# Altium project PCB_Project.PrjPcb
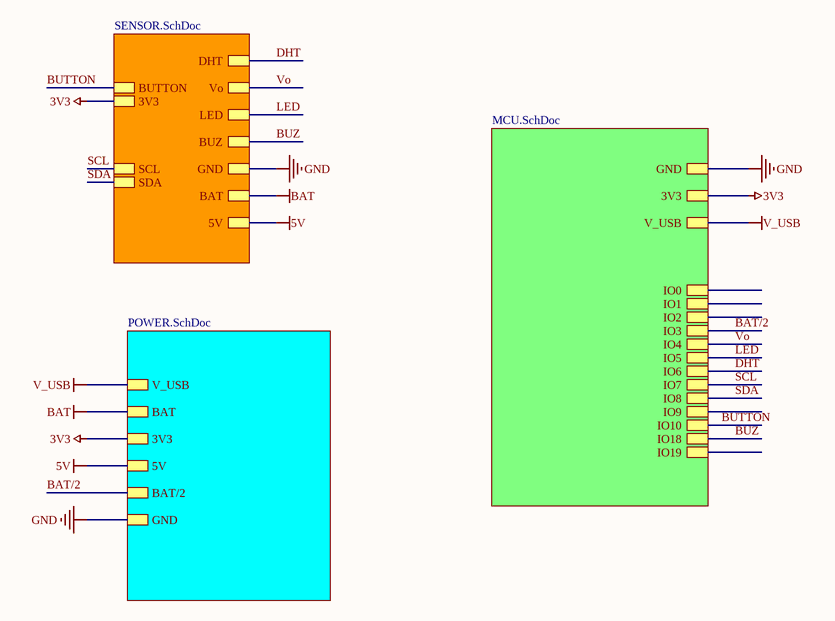
[diagram p0: AIR_QUALITY.SchDoc]
4 sheets, 62 parts. Net scope: hierarchical (ports join the sheet entries above them; power ports are global).
Board file: AIR_QUALITY.PcbDoc
Sheets:
  AIR_QUALITY.SchDoc
    Designator = SENSOR.SchDoc
    Designator = POWER.SchDoc
    MCU.SchDoc = MCU.SchDoc

## Sheet AIR_QUALITY.SchDoc
size A4; SheetNumber: 1; SheetTotal: 4

### Sub-sheets
Designator = SENSOR.SchDoc: DHT, Vo, LED, BUZ, GND, BAT, 5V, SCL, SDA, BUTTON, 3V3
Designator = POWER.SchDoc: 5V, BAT/2, BAT, 3V3, GND, V_USB
MCU.SchDoc = MCU.SchDoc: GND, 3V3, V_USB, IO0, IO1, IO2, IO3, IO4, IO5, IO6, IO7, IO8, IO9, IO10, IO18, IO19

### Nets
3V3: sheet Designator/3V3, sheet Designator/3V3, sheet MCU.SchDoc/3V3
5V: sheet Designator/5V, sheet Designator/5V
BAT: sheet Designator/BAT, sheet Designator/BAT
BUTTON: sheet Designator/GND, sheet Designator/BUTTON, sheet Designator/GND, sheet MCU.SchDoc/GND, sheet MCU.SchDoc/IO10  [also labelled GND]
V_USB: sheet Designator/V_USB, sheet MCU.SchDoc/V_USB
BAT/2: sheet Designator/BAT/2, sheet MCU.SchDoc/IO3
BUZ: sheet Designator/BUZ, sheet MCU.SchDoc/IO18
DHT: sheet Designator/DHT, sheet MCU.SchDoc/IO6
LED: sheet Designator/LED, sheet MCU.SchDoc/IO5  [project net IO5]
SCL: sheet Designator/SCL, sheet MCU.SchDoc/IO7  [project net IO7]
SDA: sheet Designator/SDA, sheet MCU.SchDoc/IO8  [project net IO8]
Vo: sheet Designator/Vo, sheet MCU.SchDoc/IO4  [project net IO4]

## Sheet SENSOR.SchDoc
size A4; SheetNumber: 4; SheetTotal: 4
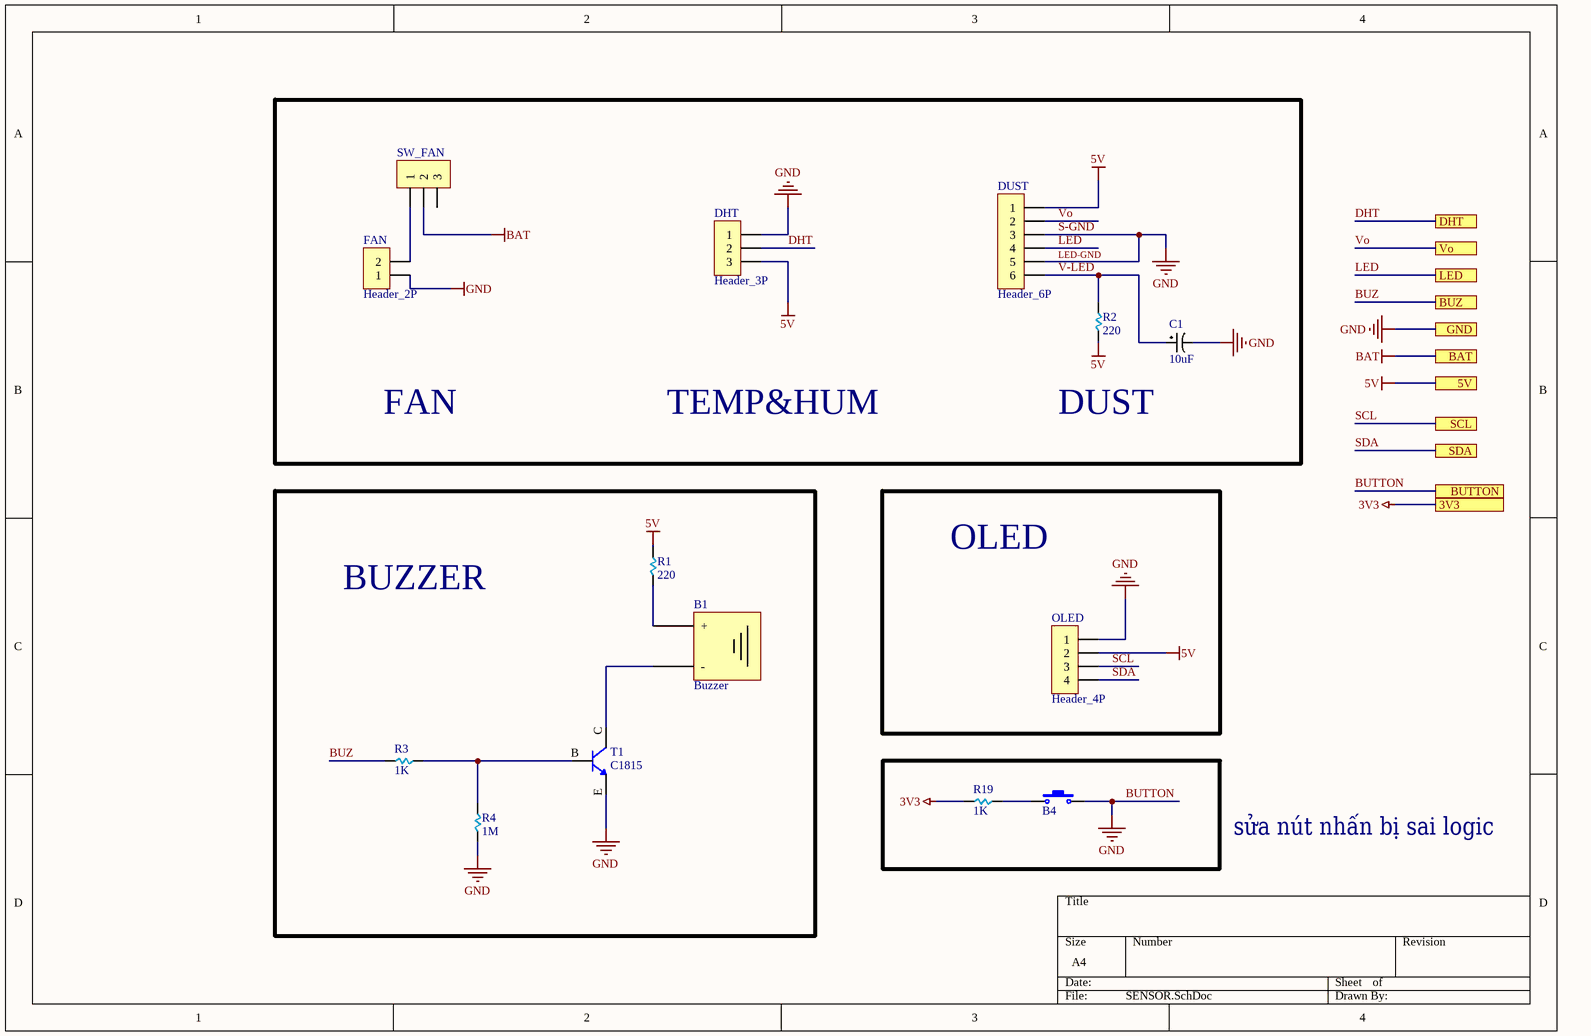
[diagram p1: SENSOR.SchDoc]

### Parts
B1  Buzzer  [Buzzer]
B4  BUTTON  [BUTTON 3x4x2]  (value not drawn)
C1  10uF  [CAP 5x11]
DHT  Header_3P  [3P_1.5_V]
DUST  Header_6P  [6P_1.5_V]
FAN  Header_2P  [2P_1.5_V]
OLED  Header_4P  [4P_1.5_V]
R1  220  [RES 0603]
R2  220  [RES 0603]
R3  1K  [RES 0603]
R4  1M  [RES 0603]
R19  1K  [RES 0603]
SW_FAN  SWITCH  [Switch SK12D07]  (value not drawn)
T1  C1815  [C1815]

### Blocks framed on the sheet
BUZZER: B1 R1 R3 R4 T1
OLED: OLED

### Ports
3V3, 5V, BAT, BUTTON, BUZ, DHT, GND, LED, SCL, SDA, Vo

### Nets
3V3: R19.2 ; port 3V3
5V: DHT.3 DUST.1 OLED.2 R1.1 R2.2 ; port 5V
BAT: SW_FAN.2 ; port BAT
BUTTON: B4.2 C1.2 DHT.1 DUST.3 DUST.5 FAN.1 OLED.1 R4.2 T1.E ; port GND, port BUTTON  [also labelled GND, LED-GND, S-GND]
BUZ: R3.1 ; port BUZ
DHT: DHT.2 ; port DHT
LED: DUST.4 ; port LED  [project net IO5]
SCL: OLED.3 ; port SCL  [project net IO7]
SDA: OLED.4 ; port SDA  [project net IO8]
V-LED: C1.1 DUST.6 R2.1
Vo: DUST.2 ; port Vo  [project net IO4]
NetB1_+: B1.+ R1.2
NetB1_-: B1.- T1.C
NetB4_1: B4.1 R19.1
NetFAN_2: FAN.2 SW_FAN.1
NetR3_2: R3.2 R4.1 T1.B

Not connected (* = marked no-connect by the designer): SW_FAN 3

### Notes on the sheet
- FAN
- TEMP&HUM
- DUST
- sửa nút nhấn bị sai logic

### Library data of the parts
C1 = Cap_P: Value: 100uF
R1-R4 R19 = RES
  R1 R2: Value: 220
  R3 R19: Value: 1K
  R4: Value: 1M

## Sheet POWER.SchDoc
size A4; SheetNumber: 3; SheetTotal: 4
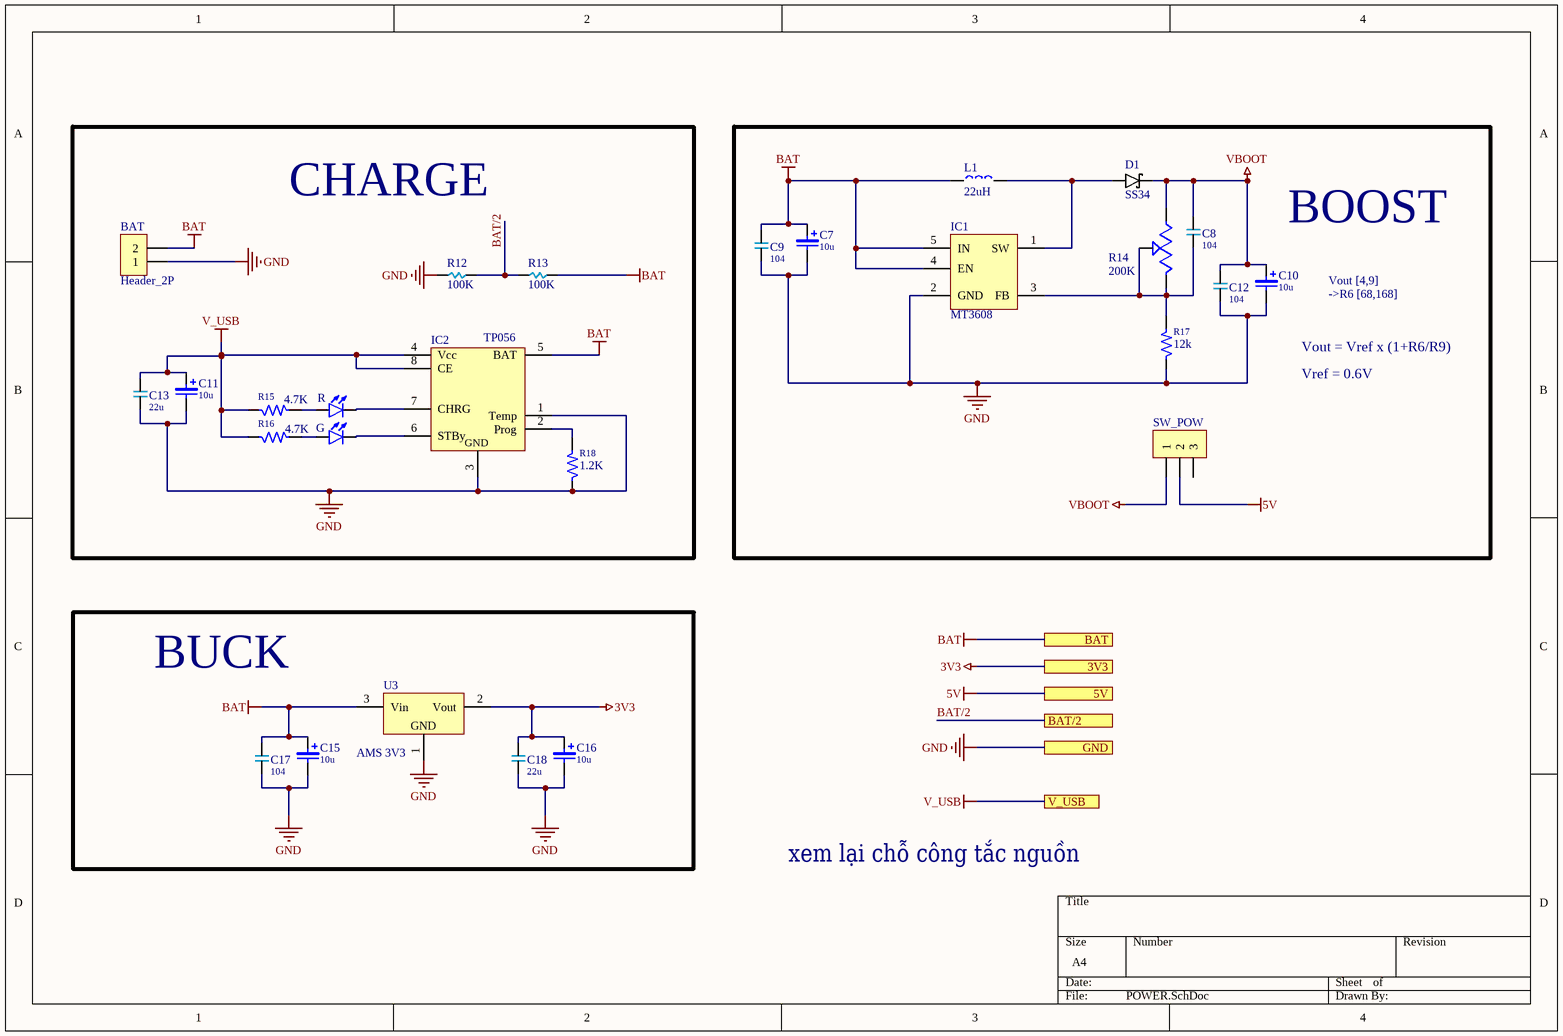
[diagram p2: POWER.SchDoc]

### Parts
BAT  Header_2P  [2P_1.5_V]
C7  10u  [CAP_T 3216 (1208)]
C8  104  [CAP 0603]
C9  104  [CAP 0603]
C10  10u  [CAP_T 3216 (1208)]
C11  10u  [CAP_T 3216 (1208)]
C12  104  [CAP 0603]
C13  22u  [CAP 0603]
C15  10u  [CAP_T 3216 (1208)]
C16  10u  [CAP_T 3216 (1208)]
C17  104  [CAP 0603]
C18  22u  [CAP 0603]
D1  SS34  [DO214AC-SMA]
G  Green  [LED 0603]  (value not drawn)
IC1  MT3608  [SOT23-6]
IC2  TP056  [SOIC 8]
L1  22uH  [INDUCTOR 0630]
R  Green  [LED 0603]  (value not drawn)
R12  100K  [RES 0603]
R13  100K  [RES 0603]
R14  200K  [RES VARIABLE]
R15  4.7K  [RES 0603]
R16  4.7K  [RES 0603]
R17  12k  [RES 0603]
R18  1.2K  [RES 0603]
SW_POW  SWITCH  [Switch SK12D07]  (value not drawn)
U3  AMS 3V3  [SOT223]

### Blocks framed on the sheet
CHARGE: BAT C11 C13 G IC2 R R12 R13 R15 R16 R18
BOOST: C7-C10 C12 D1 IC1 L1 R14 R17 SW_POW
BUCK: C15-C18 U3

### Ports
3V3, 5V, BAT, BAT/2, GND, V_USB

### Nets
3V3: C16.1 C18.2 U3.2(Vout) ; port 3V3
5V: SW_POW.2 ; port 5V
BAT: BAT.2 C7.1 C9.2 C15.1 C17.2 IC1.4(EN) IC1.5(IN) IC2.5(BAT) L1.1 R13.1 U3.3(Vin) ; port BAT
GND: BAT.1 C7.2 C9.1 C10.2 C11.2 C12.1 C13.1 C15.2 C16.2 C17.1 C18.1 IC1.2(GND) IC2.1(Temp) IC2.3(Gnd) R12.2 R17.1 R18.1 U3.1(gnd) ; port GND  [project net BUTTON]
V_USB: C11.1 C13.2 IC2.4(Vcc) IC2.8(CE) R15.1 R16.1 ; port V_USB
VBOOT: C8.2 C10.1 C12.2 D1.K R14.1 SW_POW.1
BAT/2: R12.1 R13.2 ; port BAT/2
NetC8_1: C8.1 IC1.3(FB) R14.2 R14.3 R17.2
NetD1_A: D1.A IC1.1(SW) L1.2
NetG_A: G.A R16.2
NetG_K: G.K IC2.6(STBy)
NetIC2_2: IC2.2(Prog) R18.2
NetIC2_7: IC2.7(CHRG) R.K
NetR_A: R.A R15.2

Not connected (* = marked no-connect by the designer): SW_POW 3

### Notes on the sheet
- Vout [4,9]
- ->R6 [68,168]
- Vout = Vref x (1+R6/R9)
- Vref = 0.6V
- xem lại chỗ công tắc nguồn
- (in symbol AMS1117) GND
- (in symbol TP4056) GND

### Library data of the parts
C7 C10 C11 C15 C16 = CAP_T: Value: 10u
C8 C9 C12 C13 C17 C18 = CAP
  C8 C9 C12 C17: Value: 104
  C13 C18: Value: 22u
D1 = DIODE S
G R = LED SM: Value: Green
IC2 = TP4056
L1 = IDT: Value: 22uH
R12 R13 = RES: Value: 100K
R14 = Res_variable: SMD
R15-R18 = Res SMD: Res 0805
U3 = AMS1117

## Sheet MCU.SchDoc
size A4; SheetNumber: 2; SheetTotal: 4
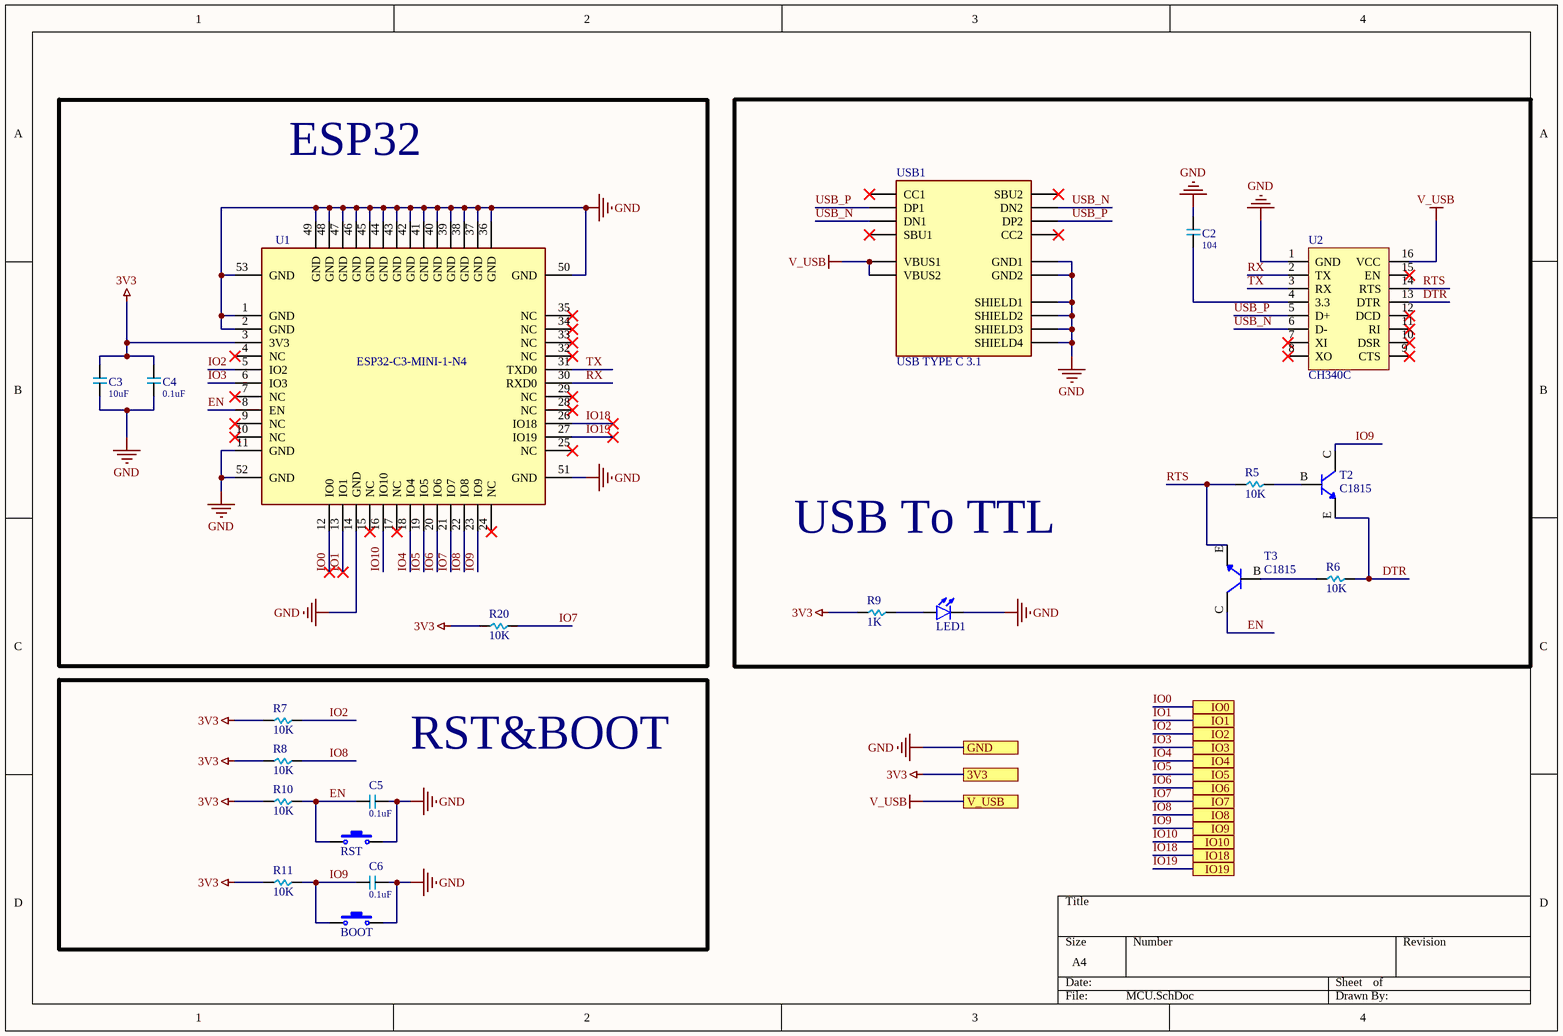
[diagram p3: MCU.SchDoc]

### Parts
BOOT  BUTTON  [BUTTON 3x4x2]  (value not drawn)
C2  104  [CAP 0603]
C3  10uF  [CAP 0603]
C4  0.1uF  [CAP 0603]
C5  0.1uF  [CAP 0603]
C6  0.1uF  [CAP 0603]
LED1  Green  [LED 0603]  (value not drawn)
R5  10K  [RES 0603]
R6  10K  [RES 0603]
R7  10K  [RES 0603]
R8  10K  [RES 0603]
R9  1K  [RES 0603]
R10  10K  [RES 0603]
R11  10K  [RES 0603]
R20  10K  [RES 0603]
RST  BUTTON  [BUTTON 3x4x2]  (value not drawn)
T2  C1815  [C1815]
T3  C1815  [C1815]
U1  ESP32-C3-MINI-1-N4  [ESP32-C3-MINI-1-N4]
U2  CH340C  [SOP16]
USB1  USB TYPE C 3.1  [USB TYPE C 3.1]

### Blocks framed on the sheet
ESP32: C3 C4 R20 U1
USB To TTL: C2 LED1 R5 R6 R9 T2 T3 U2 USB1
RST&BOOT: BOOT C5 C6 R7 R8 R10 R11 RST

### Ports
3V3, GND, IO0, IO1, IO2, IO3, IO4, IO5, IO6, IO7, IO8, IO9, IO10, IO18, IO19, V_USB

### Nets
3V3: C3.2 C4.2 R7.2 R8.2 R9.2 R10.2 R11.2 R20.2 U1.3(3V3) ; port 3V3
GND: BOOT.2 C2.2 C3.1 C4.1 C5.2 C6.2 LED1.K RST.2 U1.1(GND) U1.2(GND) U1.11(GND) U1.14(GND) U1.16(IO10) U1.36(GND) U1.37(GND) U1.38(GND) U1.39(GND) U1.40(GND) U1.41(GND) U1.42(GND) U1.43(GND) U1.44(GND) U1.45(GND) U1.46(GND) U1.47(GND) U1.48(GND) U1.49(GND) U1.50(GND) U1.51(GND) U1.52(GND) U1.53(GND) U2.1(GND) USB1.A1B12(GND1) USB1.B1A12(GND2) USB1.SH1(SHIELD1) USB1.SH2(SHIELD2) USB1.SH3(SHIELD3) USB1.SH4(SHIELD4) ; port IO10, port GND  [also labelled IO10]  [project net BUTTON]
V_USB: U2.16(VCC) USB1.A4B9(VBUS1) USB1.B4A9(VBUS2) ; port V_USB
DTR: R6.1 T2.E U2.13(DTR)
EN: C5.1 R10.1 RST.1 T3.C U1.8(EN)
IO0: U1.12(IO0) ; port IO0
IO1: U1.13(IO1) ; port IO1
IO2: R7.1 U1.5(IO2) ; port IO2
IO3: U1.6(IO3) ; port IO3  [project net BAT/2]
IO4: U1.18(IO4) ; port IO4
IO5: U1.19(IO5) ; port IO5
IO6: U1.20(IO6) ; port IO6  [project net DHT]
IO7: R20.1 U1.21(IO7) ; port IO7
IO8: R8.1 U1.22(IO8) ; port IO8
IO9: BOOT.1 C6.1 R11.1 T2.C U1.23(IO9) ; port IO9
IO18: U1.26(IO18) ; port IO18  [project net BUZ]
IO19: U1.27(IO19) ; port IO19
RTS: R5.2 T3.E U2.14(RTS)
RX: U1.30(RXD0) U2.2(TX)
TX: U1.31(TXD0) U2.3(RX)
USB_N: U2.6(D-) USB1.A7(DN1) USB1.B7(DN2)
USB_P: U2.5(D+) USB1.A6(DP1) USB1.B6(DP2)
NetC2_1: C2.1 U2.4(3.3)
NetLED1_A: LED1.A R9.1
NetR5_1: R5.1 T2.B
NetR6_2: R6.2 T3.B

Not connected (* = marked no-connect by the designer): U1 4(NC)* 7(NC)* 9(NC)* 10(NC)* 15(NC)* 17(NC)* 24(NC)* 25(NC)* 28(NC)* 29(NC)* 32(NC)* 33(NC)* 34(NC)* 35(NC)*; U2 7(XI)* 8(XO)* 9(CTS)* 10(DSR)* 11(RI)* 12(DCD)* 15(EN)*; USB1 A5(CC1)* A8(SBU1)* B5(CC2)* B8(SBU2)*

### Library data of the parts
C2-C6 = CAP
  C2: Value: 104
  C3: Value: 10uF
  C4-C6: Value: 0.1uF
LED1 = LED SM: Value: Green
R5-R11 R20 = RES
  R5-R8 R10 R11 R20: Value: 10K
  R9: Value: 1K
U1 = ESP32-C3-MINI-1-N4: MF: {'manufacturer': u'Espressif Systems'}; Package: None; Price: None; Value: *; MP: ESP32-C3-MINI-1-N4; Availability: Unavailable
U2 = CH340G
USB1 = USB TYPE C 3.1: 16P

## Nets that join several sheets
3V3: SENSOR (R19.2), POWER (C16.1 C18.2 U3.2), MCU (9 pins)
5V: SENSOR (5 pins), POWER (SW_POW.2)
BAT: SENSOR (SW_FAN.2), POWER (11 pins)
BUTTON: SENSOR (9 pins), POWER (18 pins), MCU (38 pins)
V_USB: POWER (6 pins), MCU (U2.16 USB1.A4B9 USB1.B4A9)
BAT/2: POWER (R12.1 R13.2), MCU (U1.6)
BUZ: SENSOR (R3.1), MCU (U1.26)
DHT: SENSOR (DHT.2), MCU (U1.20)
IO4: SENSOR (DUST.2), MCU (U1.18)
IO5: SENSOR (DUST.4), MCU (U1.19)
IO7: SENSOR (OLED.3), MCU (R20.1 U1.21)
IO8: SENSOR (OLED.4), MCU (R8.1 U1.22)